# EAGLE design CCM0006 (EAGLE 9.1.3)
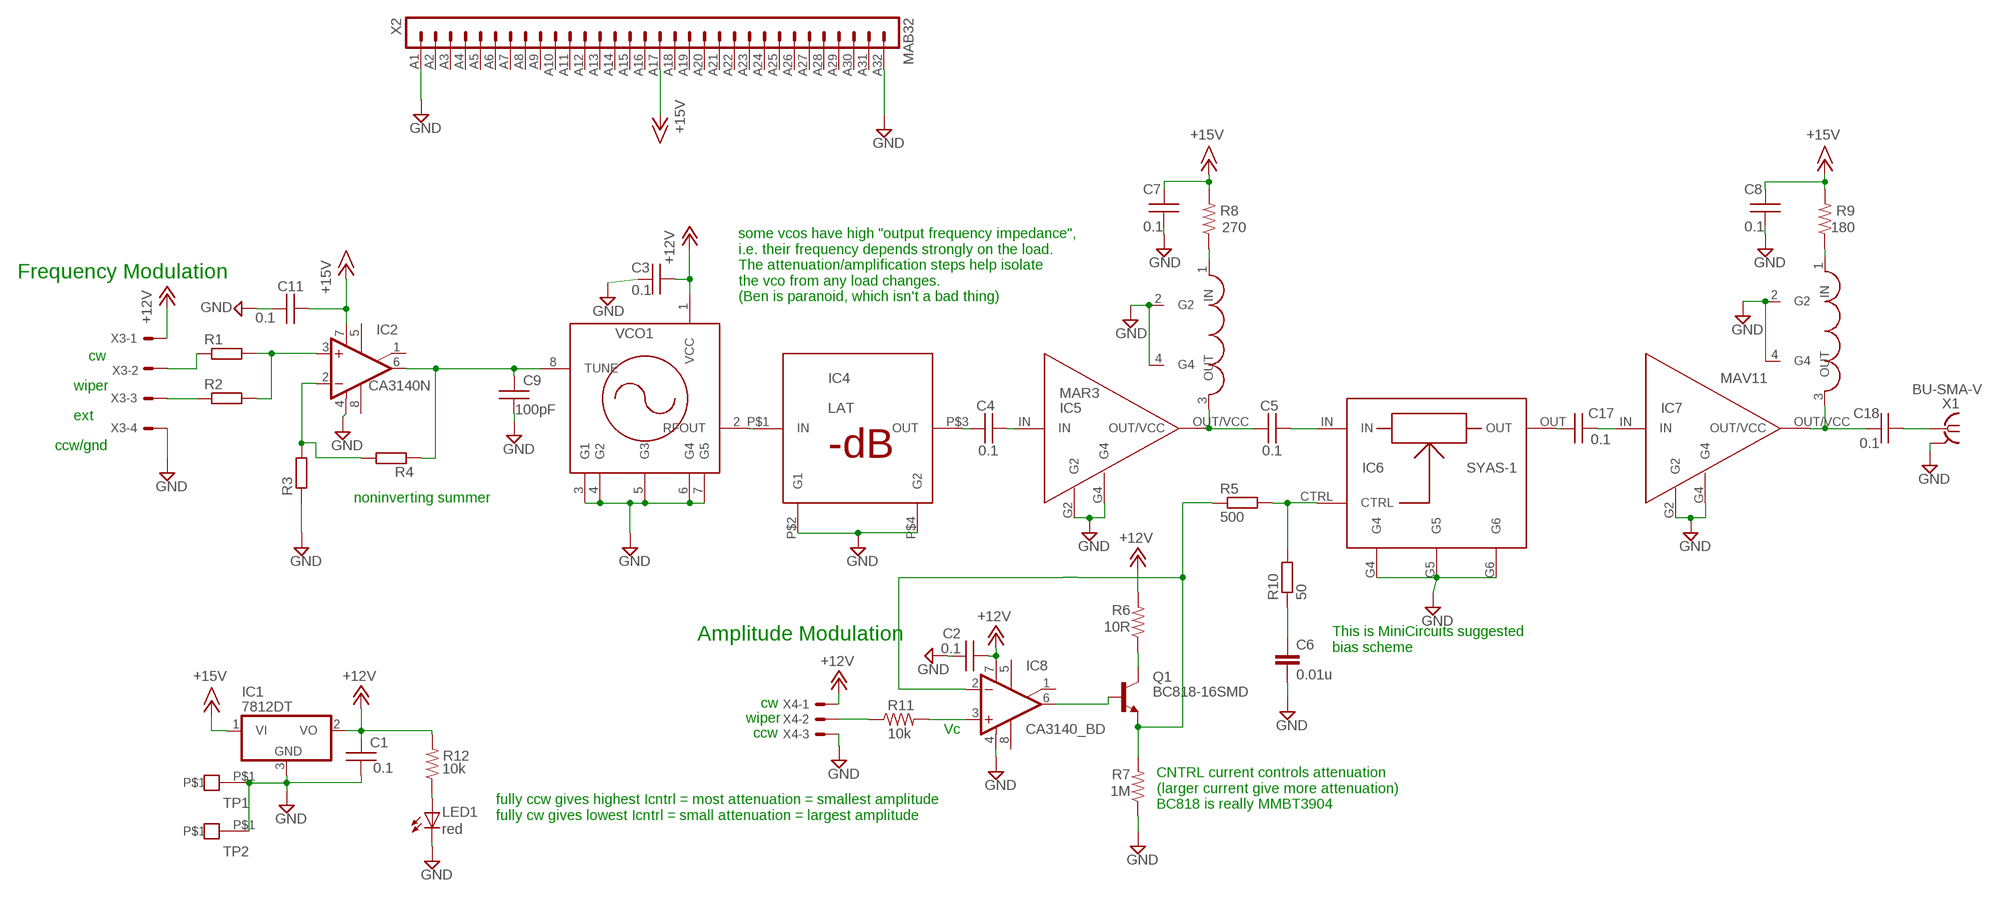
[diagram p0: schematic, sheet 1]

## Parts
C1  0.1  CAPACITOR0805  [0805]
C2  0.1  CAPACITOR0805  [0805]
C3  0.1  CAPACITOR0805  [0805]
C4  0.1  CAPACITOR2010  [2010]
C5  0.1  CAPACITOR2010  [2010]
C6  0.01u  C-EUC0805  [C0805]
C7  0.1  CAPACITOR0805  [0805]
C8  0.1  CAPACITOR0603  [0603]
C9  100pF  CAPACITOR0805  [0805]
C11  0.1  CAPACITOR0805  [0805]
C17  0.1  CAPACITOR2010  [2010]
C18  0.1  CAPACITOR2010  [2010]
IC1  7812DT  [TO252]
IC2  CA3140N  [DIL08]
IC4  LAT  [MMM168]
IC5  MAR3  [MAR]
IC6  SYAS-1  [TTT166]
IC7  MAV11  [MAR]
IC8  CA3140_BD  [SO08]
L1  TCCH-80  [PL-147]
L2  TCCH-80  [PL-147]
LED1  red  LEDCHIPLED_0603  [CHIPLED_0603]
Q1  BC818-16SMD  [SOT23-BEC]
R1  R-EU_0204/7  [0204/7]
R2  R-EU_0204/7  [0204/7]
R3  R-EU_0204/7  [0204/7]
R4  R-EU_0204/7  [0204/7]
R5  500  R-EU_R0805  [R0805]
R6  10R  RESISTOR0805  [0805]
R7  1M  RESISTOR0805  [0805]
R8  270  RESISTOR2010  [2010]
R9  180  RESISTOR2010  [2010]
R10  50  R-EU_R0805  [R0805]
R11  10k  RESISTOR0805  [0805]
R12  10k  RESISTOR0805  [0805]
TP1  TESTPOINT  [TESTPOINT]
TP2  TESTPOINT  [TESTPOINT]
VCO1  POSBIGPAD  [A01BIDPAD]
X1  BU-SMA-V  [BU-SMA-V]
X2  MAB32  [MAB32]
X3  22-23-2041  [22-23-2041]
X4  22-23-2031  [22-23-2031]

## Nets
+12V: C1.1 C2.2 C3.1 IC1.2(VO) IC8.7(V+) R6.2 R12.2 VCO1.1(VCC) X3.1 X4.1
+15V: C7.1 C8.1 C11.2 IC1.1(VI) IC2.7(V+) R8.2 R9.2 X2.A17
GND: C1.2 C2.1 C3.2 C6.2 C7.2 C8.2 C9.2 C11.1 IC1.3(GND) IC2.4(V-) IC4.P$2(G1) IC4.P$4(G2) IC5.G2 IC5.G4 IC6.G4 IC6.G5 IC6.G6 IC7.G2 IC7.G4 IC8.4(V-) L1.2(G2) L1.4(G4) L2.2(G2) L2.4(G4) LED1.C R3.1 R7.1 TP1.P$1 TP2.P$1 VCO1.3(G1) VCO1.4(G2) VCO1.5(G3) VCO1.6(G4) VCO1.7(G5) X1.2(GND) X2.A1 X2.A32 X3.4 X4.3
N$1: IC8.2(-IN) Q1.E R5.1 R7.2
N$3: IC8.6(OUT) Q1.B
N$4: R1.1 X3.2
N$5: IC6.CTRL R5.2 R10.2
N$6: R2.1 X3.3
N$7: R11.1 X4.2
N$8: IC8.3(+IN) R11.2
N$9: LED1.A R12.1
N$10: IC2.3(+IN) R1.2 R2.2
N$11: IC2.2(-IN) R3.2 R4.2
N$12: C6.1 R10.1
N$14: Q1.C R6.1
N$39: C9.1 IC2.6(OUT) R4.1 VCO1.8(TUNE)
N$40: L2.1(IN) R9.1
N$41: IC4.P$1(IN) VCO1.2(RFOUT)
N$42: C4.1 IC4.P$3(OUT)
N$43: C4.2 IC5.IN
N$44 [stripline]: C5.1 IC5.OUT/VCC L1.3(OUT)
N$45 [stripline]: C5.2 IC6.IN
N$46 [stripline]: C17.2 IC7.IN
N$47 [stripline]: C18.1 IC7.OUT/VCC L2.3(OUT)
N$48: L1.1(IN) R8.1
N$49 [stripline]: C17.1 IC6.OUT
N$50: C18.2 X1.1
Unconnected: IC2.1(ON/CMP) IC2.5(ON) IC2.8(CMP) IC8.1(ON/CMP) IC8.5(ON) IC8.8(CMP) X2.A2 X2.A3 X2.A4 X2.A5 X2.A6 X2.A7 X2.A8 X2.A9 X2.A10 X2.A11 X2.A12 X2.A13 X2.A14 X2.A15 X2.A16 X2.A18 X2.A19 X2.A20 X2.A21 X2.A22 X2.A23 X2.A24 X2.A25 X2.A26 X2.A27 X2.A28 X2.A29 X2.A30 X2.A31

## Notes on the sheet
- Frequency Modulation
- some vcos have high "output frequency impedance",
  i.e. their frequency depends strongly on the load.
  The attenuation/amplification steps help isolate 
  the vco from any load changes.
  (Ben is paranoid, which isn't a bad thing)
- cw
- wiper
- ext
- ccw/gnd
- noninverting summer
- Amplitude Modulation
- This is MiniCircuits suggested
  bias scheme
- cw
- wiper
- ccw | Vc
- CNTRL current controls attenuation
  (larger current give more attenuation)
  BC818 is really MMBT3904
- fully ccw gives highest Icntrl = most attenuation = smallest amplitude
  fully cw gives lowest Icntrl = small attenuation = largest amplitude

## Power pins joined to a net without a drawn wire
GND: X1.3(GND) X1.4(GND) X1.5(GND)

## Library data of the parts
C1-C5 C7-C9 C11 C17 C18 = ic:CAPACITOR
C6 = rcl:C-EU: CAPACITOR, European symbol
IC1 = ic:78*: Positive VOLTAGE REGULATOR Source: http://cache.national.com/ds/LM/LM78L05.pdf http://www.fairchildsemi.com/ds/LM/LM7805.pdf
IC2 = ic:CA3140: OP AMP
IC4 = ic:LAT: Minicircuits surface mount attenuator
IC5 = ic:MAR3: MiniCircuits MAR-3+ amplifier
IC6 = ic:SYAS-1: MiniCircuits voltage variable attenuator
IC7 = ic:MAV11: MiniCircuits MAV-11 amplifer, currently identical to MAR-3
IC8 = ic:CA3140_B: OP AMP
L1 L2 = ic:TCCH-80: MiniCircuits TCCH-80+ choke
LED1 = led:LED: LED OSRAM: - CHIPLED LG R971, LG N971, LY N971, LG Q971, LY Q971, LO R971, LY R971 LH N974, LH R974 LS Q976, LO Q976, LY Q976 LO Q996 - Hyper CHIPLED LW Q18S LB Q993, LB Q99A, LB R99A - SideLED LS A670, LO A670, LY A670, LG A670, LP A670 LB A673, LV A673, LT A673, LW A673 LH A674 LY A675 LS A676, LA A676, LO A676, LY A676, LW A676 LS A679, LY A679, LG A679 - Hyper Micro SIDELED® LS Y876, LA Y876, LO Y876, LY Y876 LT Y87S - SmartLED LW L88C, LW L88S LB L89C, LB L89S, LG L890 LS L89K, LO L89K, LY L89K LS L896, LA L896, LO L896, LY L896 - TOPLED LS T670, LO T670, LY T670, LG T670, LP T670 LSG T670, LSP T670, LSY T670, LOP T670, LYG T670 LG T671, LOG T671, LSG T671 LB T673, LV T673, LT T673, LW T673 LH T674 LS T676, LA T676, LO T676, LY T676, LB T676, LH T676, LSB T676, LW T676 LB T67C, LV T67C, LT T67C, LS T67K, LO T67K, LY T67K, LW E67C LS E67B, LA E67B, LO E67B, LY E67B, LB E67C, LV E67C, LT E67C LW T67C LS T679, LY T679, LG T679 LS T770, LO T770, LY T770, LG T770, LP T770 LB T773, LV T773, LT T773, LW T773 LH T774 LS E675, LA E675, LY E675, LS T675 LS T776, LA T776, LO T776, LY T776, LB T776 LHGB T686 LT T68C, LB T68C - Hyper Mini TOPLED® LB M676 - Mini TOPLED Santana® LG M470 LS M47K, LO M47K, LY M47K Source: http://www.osram.convergy.de LUXEON: - LUMILED® LXK2-PW12-R00, LXK2-PW12-S00, LXK2-PW14-U00, LXK2-PW14-V00 LXK2-PM12-R00, LXK2-PM12-S00, LXK2-PM14-U00 LXK2-PE12-Q00, LXK2-PE12-R00, LXK2-PE12-S00, LXK2-PE14-T00, LXK2-PE14-U00 LXK2-PB12-K00, LXK2-PB12-L00, LXK2-PB12-M00, LXK2-PB14-N00, LXK2-PB14-P00, LXK2-PB14-Q00 LXK2-PR12-L00, LXK2-PR12-M00, LXK2-PR14-Q00, LXK2-PR14-R00 LXK2-PD12-Q00, LXK2-PD12-R00, LXK2-PD12-S00 LXK2-PH12-R00, LXK2-PH12-S00 LXK2-PL12-P00, LXK2-PL12-Q00, LXK2-PL12-R00 Source: www.luxeon.com KINGBRIGHT: KA-3528ASYC Source: www.kingbright.com
Q1 = transistor-npn:BC818*: NPN Transistor
R1-R5 R10 = rcl:R-EU_: RESISTOR, European symbol
R6-R9 R11 R12 = ic:RESISTOR: RESISTOR, American symbol
TP1 TP2 = Fitch:TESTPOINT
VCO1 = minicirNew:POS: MiniCircuits POS-x VCO, through hole package
X1 = con-coax:BU-SMA-V: FEMALE SMA CONNECTOR Radiall distributor RS 112-3794
X2 = ic:MAB32: CONNECTOR male, 32 pins, type B, row A, grid 2.54 mm
X3 = con-molex:22-23-2041: .100" (2.54mm) Center Header - 4 Pin; MF: MOLEX; MPN: 22-23-2041; OC_FARNELL: 1462920; OC_NEWARK: 38C0355
X4 = con-molex:22-23-2031: .100" (2.54mm) Center Header - 3 Pin; MF: MOLEX; MPN: 22-23-2031; OC_FARNELL: 1462950; OC_NEWARK: 30C0862

## Net classes
1 stripline: width 1.778 mm, clearance 1.27 mm

## Board
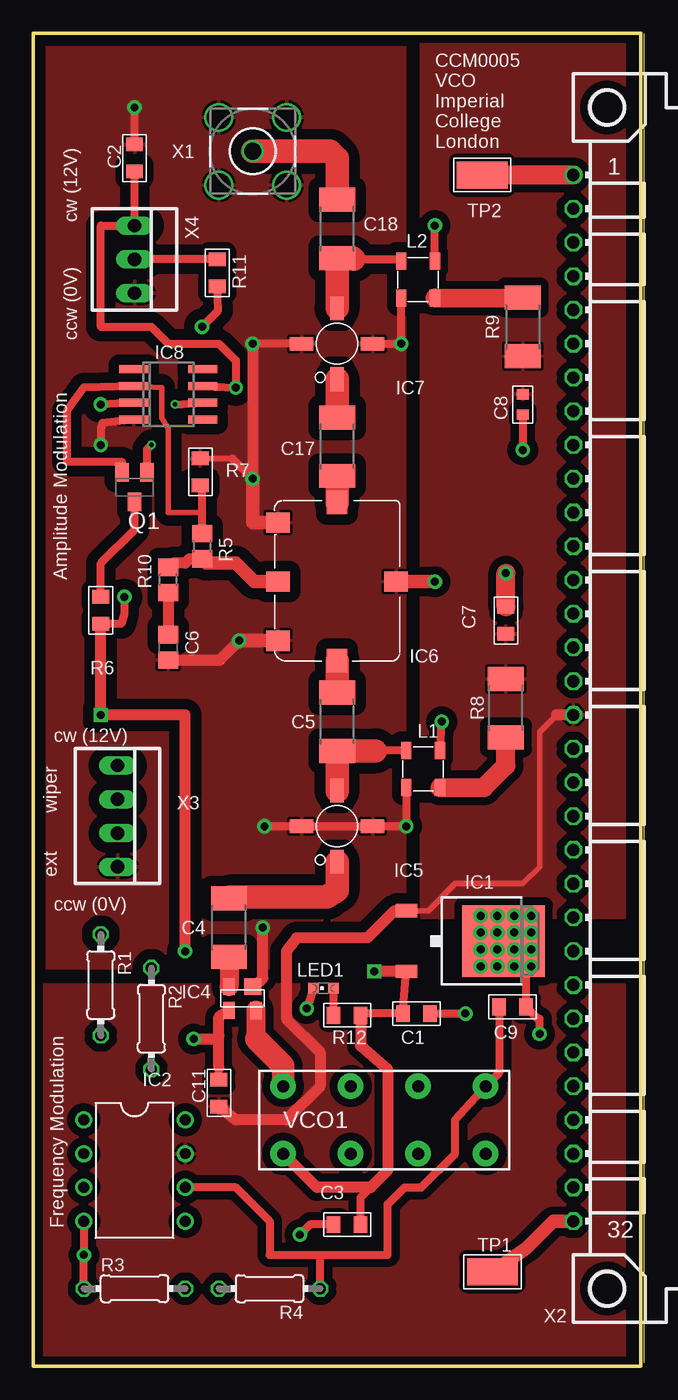
[diagram p1: board, top side]
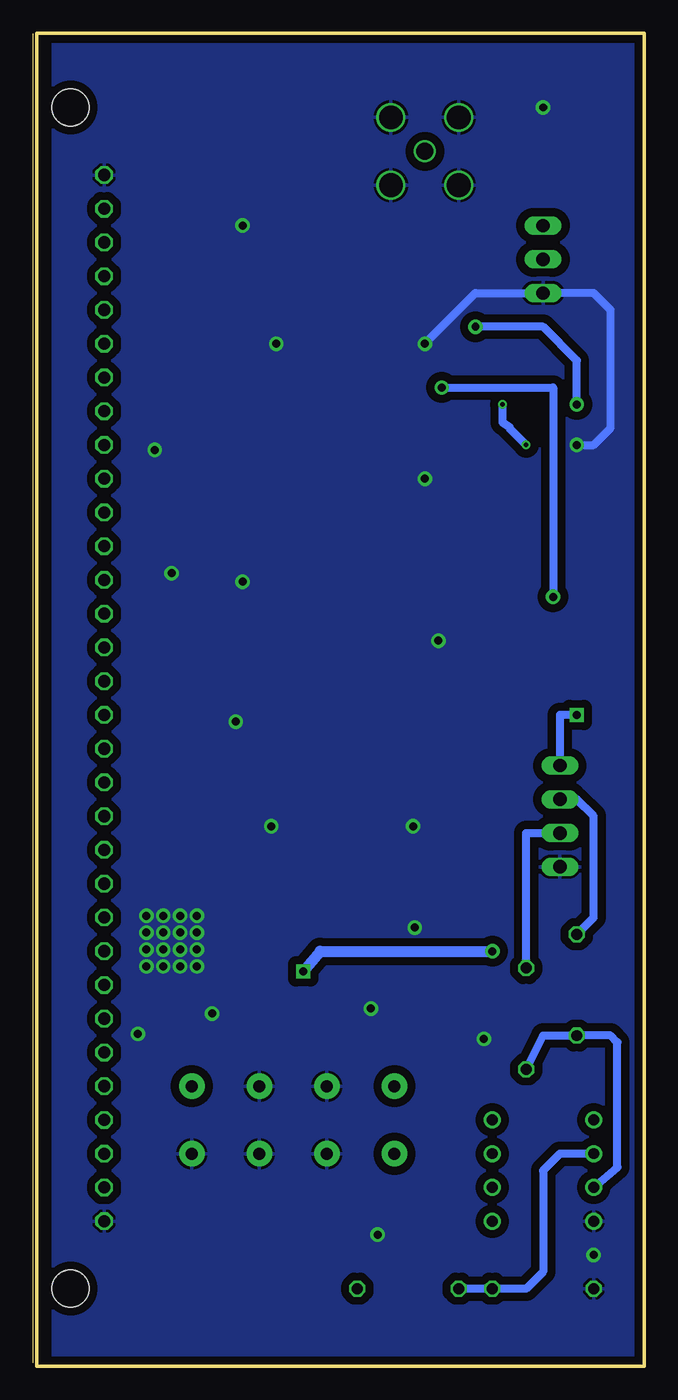
[diagram p2: board, bottom side, seen from below]

Size 45.72 x 100.33 mm. Coordinates in mm from the lower left corner, seen from the top.
Outline: 0,0 0,100.33 45.72,100.33 45.72,0 0,0
Copper layers (1*16): Top 0.035mm / dielectric 1.5mm / Bottom 0.035mm
Design rules "PCB-POOL Standard": minimum track width 0.15mm, minimum drill 0.3mm, track to track 0.15mm, track to pad 0.15mm, pad to pad 0.15mm, via to via 0.15mm, smd to smd 0.15mm, copper to edge 0.3mm, drill to drill 0.2mm, minimum pad ring 0.2mm, minimum via ring 0.15mm, stop-mask expansion 0.075mm, vias tented up to drill 0mil, thermal gap 0.2mm

### Footprints (pad centres in the part's own frame; a part is rotated, then mirrored left to right if it is on the bottom)
0805 = smd 1.016 x 1.27: 1 -1.016,0; 2 1.016,0
2010 = smd 1.8 x 2.7: 1 -2.2,0; 2 2.2,0
C0805 = smd 1.3 x 1.5: 1 -0.95,0; 2 0.95,0
0603 = smd 0.762 x 0.889: 1 -0.762,0; 2 0.762,0
TO252 = smd 1 x 1.6: 1 -2.28,-4.8; 2 2.28,-4.8 | smd 5.4 x 6.2: 3 0,2.5
DIL08 = drill 0.813 pad 1.27: 1 -3.81,-3.81; 2 -1.27,-3.81; 3 1.27,-3.81; 4 3.81,-3.81; 5 3.81,3.81; 6 1.27,3.81; 7 -1.27,3.81; 8 -3.81,3.81
MMM168 = smd 0.889 x 1.27: P$1 -1.016,0.889; P$2 1.016,0.889; P$3 1.016,-0.889 | smd 1.27 x 1.27: P$4 -0.762,-0.889
MAR = smd 1.016 x 1.778: G2 0,2.667; G4 0,-2.667 | smd 1.778 x 1.016: IN -2.667,0; OUT/VCC 2.667,0
TTT166 = smd 1.524 x 1.778: CTRL 0,-4.445; G4 0,4.445; G5 -4.445,-4.445; G6 4.445,-4.445 | smd 1.778 x 1.524: IN 5.969,0; OUT -5.969,0
SO08 = smd 0.6 x 2.2: 1 -1.905,-2.6; 2 -0.635,-2.6; 3 0.635,-2.6; 4 1.905,-2.6; 5 1.905,2.6; 6 0.635,2.6; 7 -0.635,2.6; 8 -1.905,2.6
PL-147 = smd 0.762 x 1.27: 1 -1.27,1.397; 2 1.27,1.397; 3 1.27,-1.397; 4 -1.27,-1.397
CHIPLED_0603 = smd 0.8 x 0.8: A 0,-0.75; C 0,0.75
SOT23-BEC = smd 1 x 1.4: B -0.95,-1.1; C 0,1.1; E 0.95,-1.1
0204/7 = drill 0.813 octagon: 1 -3.81,0; 2 3.81,0
R0805 = smd 1.3 x 1.5: 1 -0.95,0; 2 0.95,0
TESTPOINT = smd 3.81 x 2.032: P$1 0,0
A01BIDPAD = drill 0.9 pad 1.93: 1 -10.16,-3.81; 2 -10.16,1.27; 3 -5.08,-3.81; 4 -5.08,1.27; 5 0,-3.81; 6 0,1.27; 7 5.08,-3.81; 8 5.08,1.27
BU-SMA-V = drill 1.27: 1 0,0 | drill 1.778: 2 -2.55,2.55; 3 2.55,2.55; 4 2.55,-2.55; 5 -2.55,-2.55
MAB32 = drill 0.914 octagon: A1 -2.54,39.37; A2 -2.54,36.83; A3 -2.54,34.29; A4 -2.54,31.75; A5 -2.54,29.21; A6 -2.54,26.67; A7 -2.54,24.13; A8 -2.54,21.59; A9 -2.54,19.05; A10 -2.54,16.51; A11 -2.54,13.97; A12 -2.54,11.43; A13 -2.54,8.89; A14 -2.54,6.35; A15 -2.54,3.81; A16 -2.54,1.27; A17 -2.54,-1.27; A18 -2.54,-3.81; A19 -2.54,-6.35; A20 -2.54,-8.89; A21 -2.54,-11.43; A22 -2.54,-13.97; A23 -2.54,-16.51; A24 -2.54,-19.05; A25 -2.54,-21.59; A26 -2.54,-24.13; A27 -2.54,-26.67; A28 -2.54,-29.21; A29 -2.54,-31.75; A30 -2.54,-34.29; A31 -2.54,-36.83; A32 -2.54,-39.37 | hole 2.794: 0,44.45; 0,-44.45
22-23-2041 = drill 1 long: 1 -3.81,0; 2 -1.27,0; 3 1.27,0; 4 3.81,0
22-23-2031 = drill 1 long: 1 -2.54,0; 2 0,0; 3 2.54,0

### Placement (x,y rotation side)
C1  28.83,26.54 0 top
C2  7.62,90.93 270 top
C3  23.62,10.67 180 top
C4  14.73,33.02 90 top
C5  22.86,48.51 90 top
C6  10.16,54.1 270 top
C7  35.56,56.13 90 top
C8  36.83,72.39 270 top
C9  36.07,27.05 0 top
C11  13.97,20.57 270 top
C17  22.86,69.22 90 top
C18  22.86,85.6 90 top
IC1  32.89,32 270 top
IC2  7.62,14.73 270 top
IC4  15.75,27.69 180 top
IC5  22.86,40.64 90 top
IC6  22.86,59.05 270 top
IC7  22.86,76.96 90 top
IC8  10.16,73.15 270 top
L1  29.34,44.96 180 top
L2  28.96,81.79 180 top
LED1  21.84,28.45 90 top
Q1  7.62,66.17 180 top
R1  5.08,28.7 270 top
R2  8.89,26.16 270 top
R3  7.62,5.84 0 top
R4  17.78,5.84 180 top
R5  12.7,61.72 270 top
R6  5.08,56.9 270 top
R7  12.57,67.31 270 top
R8  35.56,49.53 90 top
R9  36.83,78.23 270 top
R10  10.16,59.18 90 top
R11  13.84,82.3 270 top
R12  23.62,26.42 0 top
TP1  34.54,7.11 0 top
TP2  33.78,89.66 0 top
VCO1  28.96,19.81 0 top
X1  16.51,91.44 0 top
X2  43.18,50.29 0 top
X3  6.35,41.4 270 top
X4  7.62,83.31 270 top

### Tracks (layer width: path | path; a pad name or v marks a point on that pad's centre or on a via)
+12V  (via drill 0.6)
  Top 0.61: IC1.2 28.07,29.72 C1.1 24.76,26.54 R12.2 | C2.2 X4.1 5.08,85.85 5.08,78.23 8.89,78.23 10.16,76.96 13.97,76.96 15.24,75.69 v15.24,73.66 IC8.7 | v6.86,57.91 6.86,56.64 6.6,55.88 R6.2 | C3.1 24.64,12.7 25.4,13.46
  Top 0.813: IC1.2 v25.65,29.72 | R12.2 24.64,24.13 26.67,22.35 26.67,14.73 25.4,13.46 21.34,13.46 VCO1.1 | R6.2 v5.08,49.02 11.43,49.02 v11.43,31.24
  Bottom 0.61: v5.08,49.02 6.35,49.02 X3.1 | v15.24,73.66 6.86,73.66 v6.86,57.91
  Bottom 0.813: v25.65,29.72 24.38,31.24 v11.43,31.24
+15V
  Top 0.406: IC1.1 29.71,34.28 31.75,36.32 36.83,36.32 38.1,37.59 38.1,47.75 39.37,49.02
  Top 0.813: C11.2 15.24,18.54 19.05,18.54 21.59,21.08 21.59,23.62 19.05,26.16 19.05,31.24 19.81,32.26 25.15,32.26 27.17,34.28 IC1.1 | X2.A17 39.37,49.02
  pour Top (isolate 0.61): 44.45,99.82 44.45,33.78 29.21,33.78 29.21,99.82
  pour Top (isolate 0.61): 44.45,28.7 0,28.7 0,0.76 44.45,0.76
GND  (via drill 0.6)
  Top 0.406: R7.1 14.99,68.33
  Top 0.61: IC1.3 35.39,31.37 v34.92,31.37 | C1.2 v32.51,26.54 | L1.4 v30.73,48.51 | L1.2 v28.07,40.64 IC5.G2 | IC5.G2 IC5.G4 | IC5.G2 v17.4,40.64 | IC7.G2 v16.51,76.96 | C8.2 v36.83,68.96 | L2.4 v30.23,85.85 | IC7.G4 v27.69,76.96 L2.2 | LED1.C v20.57,26.92 | v38.1,25.02 38.1,26.16 37.97,26.16 C9.2 37.08,29.72 v37.46,30.1 | v33.66,33.91 v34.92,33.91 | C11.1 13.97,22.48 | IC8.4 5.21,70.99 5.08,70.61 v5.08,69.34 | 14.99,68.33 v16.51,66.8 | C2.1 v7.62,94.74 | R3.1 v3.81,8.38 IC2.4 | C3.2 20.83,10.67 v20.07,9.91
  Top 0.813: IC4.P$4 16.64,28.57 17.27,29.21 v17.27,33.02 | 13.97,22.48 13.97,24.89 | 13.97,24.89 13.97,26.29 IC4.P$2 | v12.07,24.64 13.72,24.64 13.97,24.89 | C6.2 14.04,53.15 v15.49,54.61 | v16.51,76.96 v16.51,66.8
  Top 1.016: IC6.G5 16.51,63.5 v16.51,66.8 | IC6.G4 v30.23,59.05 | IC6.G6 v15.49,54.61 | TP1.P$1 37.08,8.89 39.12,10.92 X2.A32
  Top 1.422: X2.A1 TP2.P$1 | C7.2 v35.56,59.69
  Bottom 0.61: v5.08,69.34 3.81,69.34 2.54,70.61 2.54,79.5 3.81,80.77 X4.3 12.7,80.77 v16.51,76.96
  other vias: 37.46,32.64 37.46,31.37 37.46,33.91 36.19,32.64 36.19,31.37 36.19,30.1 36.19,33.91 34.92,32.64 34.92,30.1 33.66,32.64 33.66,31.37 33.66,30.1
  pour Bottom (isolate 0.61): 0,0.76 0,99.82 44.45,99.82 44.45,0.76
  pour Top (isolate 0.813): 0,29.97 0,99.82 27.94,99.82 27.94,29.97
N$1
  Top 0.406: 12.7,64.26 10.16,64.26 10.16,70.61 9.65,71.37 9.65,73.66 IC8.2
  Top 0.61: R5.1 12.7,64.26 12.7,66.17 R7.2 | Q1.E 6.67,68.07 2.54,68.07 2.54,71.88 3.81,73.66 IC8.2
N$3  (via drill 0.35)
  Top 0.61: Q1.B 8.57,69.02 v8.89,69.34 | v10.67,72.39 IC8.6
  Bottom 0.61: v8.89,69.34 10.16,70.61 10.16,70.7 10.67,71.04 v10.67,72.39
N$4
  Bottom 0.61: R1.1 3.81,33.78 3.81,41.4 5.08,42.67 X3.2
N$5
  Top 0.813: 13.02,60.45 R5.2 11.75,60.77 11.43,60.45 10.48,60.45 R10.2
  Top 1.016: IC6.CTRL 16.64,59.05 15.24,60.45 13.02,60.45
N$6
  Bottom 0.61: R2.1 8.89,40.13 X3.3
N$7
  Top 0.61: R11.1 X4.2
N$8  (via drill 0.6)
  Top 0.61: IC8.3 v5.08,72.39 | v12.7,78.23 13.92,79.45 R11.2
  Bottom 0.61: v5.08,72.39 5.08,75.69 7.62,78.23 v12.7,78.23
N$9
  Top 0.61: R12.1 LED1.A
N$10
  Bottom 0.61: R2.2 7.62,24.89 R1.2 2.54,24.89 2.03,24.38 2.03,14.99 IC2.3
N$11
  Bottom 0.61: IC2.2 6.35,16 7.62,14.73 7.62,7.11 8.89,5.84 R3.2 R4.2
N$12
  Top 0.813: R10.1 C6.1
N$14
  Top 0.61: R6.1 5.08,60.45 7.62,62.99 Q1.C
N$39
  Top 0.61: 21.59,8.38 17.78,8.38 17.78,10.92 15.24,13.46 IC2.6 | 21.59,8.38 26.67,8.38 26.67,12.19 27.94,13.46 29.21,13.46 31.75,16 31.75,18.54 VCO1.8 35.05,22.1 C9.1 | R4.1 21.59,8.38
N$40
  Top 1.422: L2.1 R9.1
N$41
  Top 1.422: 16.76,24.64 IC4.P$1
  Top 1.676: VCO1.2 18.8,22.61 16.76,24.64
N$42
  Top 1.422: C4.1 IC4.P$3
N$43
  Top 1.778: IC5.IN 22.86,35.81 22.1,35.31 14.82,35.31 C4.2
N$44
  Top 0.61: L1.3 25.78,46.35 25.74,46.31
  Top 1.778: IC5.OUT/VCC C5.1 25.74,46.31
N$45
  Top 1.778: IC6.IN C5.2
N$46
  Top 1.778: IC7.IN C17.2
N$47
  Top 0.61: 24.13,83.31 27.56,83.31 L2.3
  Top 1.778: IC7.OUT/VCC C18.1 24.04,83.4 24.13,83.31
N$48
  Top 1.422: L1.1 33.91,43.56 35.56,45.21 R8.1
N$49
  Top 1.778: IC6.OUT C17.1
N$50
  Top 1.778: X1.1 22.35,91.44 22.86,90.93 C18.2

### Text on the board
tNames: CCM0005 / VCO / Imperial / College / London | cw (12V) | ccw (0V) | Amplitude Modulation | cw (12V) | wiper | ext | ccw (0V) | Frequency Modulation